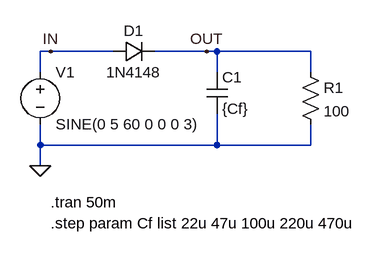
[diagram p0: schematic rectifier_halfwave_filter.asc]
rectifier_halfwave_filter.asc, the LTspice schematic file:
Version 4
SHEET 1 1048 956
WIRE 112 464 96 464
WIRE 208 464 112 464
WIRE 352 464 272 464
WIRE 368 464 352 464
WIRE 512 464 368 464
WIRE 96 496 96 464
WIRE 368 496 368 464
WIRE 512 496 512 464
WIRE 96 608 96 576
WIRE 368 608 368 560
WIRE 368 608 96 608
WIRE 512 608 512 576
WIRE 512 608 368 608
WIRE 96 640 96 608
FLAG 96 640 0
FLAG 112 464 IN
FLAG 352 464 OUT
SYMBOL diode 208 480 R270
WINDOW 0 32 32 VTop 2
WINDOW 3 0 32 VBottom 2
SYMATTR InstName D1
SYMATTR Value 1N4148
SYMBOL voltage 96 480 R0
WINDOW 123 0 0 Left 0
WINDOW 39 0 0 Left 0
SYMATTR InstName V1
SYMATTR Value SINE(0 5 60 0 0 0 3)
SYMBOL res 496 480 R0
SYMATTR InstName R1
SYMATTR Value 100
SYMBOL cap 352 496 R0
SYMATTR InstName C1
SYMATTR Value {Cf}
TEXT 112 696 Left 2 !.tran 50m
TEXT 112 728 Left 2 !.step param Cf list 22u 47u 100u 220u 470u

The netlist it stands for:
* rectifier_halfwave_filter.asc
D1 IN OUT 1N4148
V1 IN 0 SINE(0 5 60 0 0 0 3)
R1 OUT 0 100
C1 OUT 0 {Cf}
.model D D
.lib standard.dio
.tran 50m
.step param Cf list 22u 47u 100u 220u 470u
.backanno
.end